# EAGLE schematic cheetah_driver_2 (EAGLE 6.5.0)
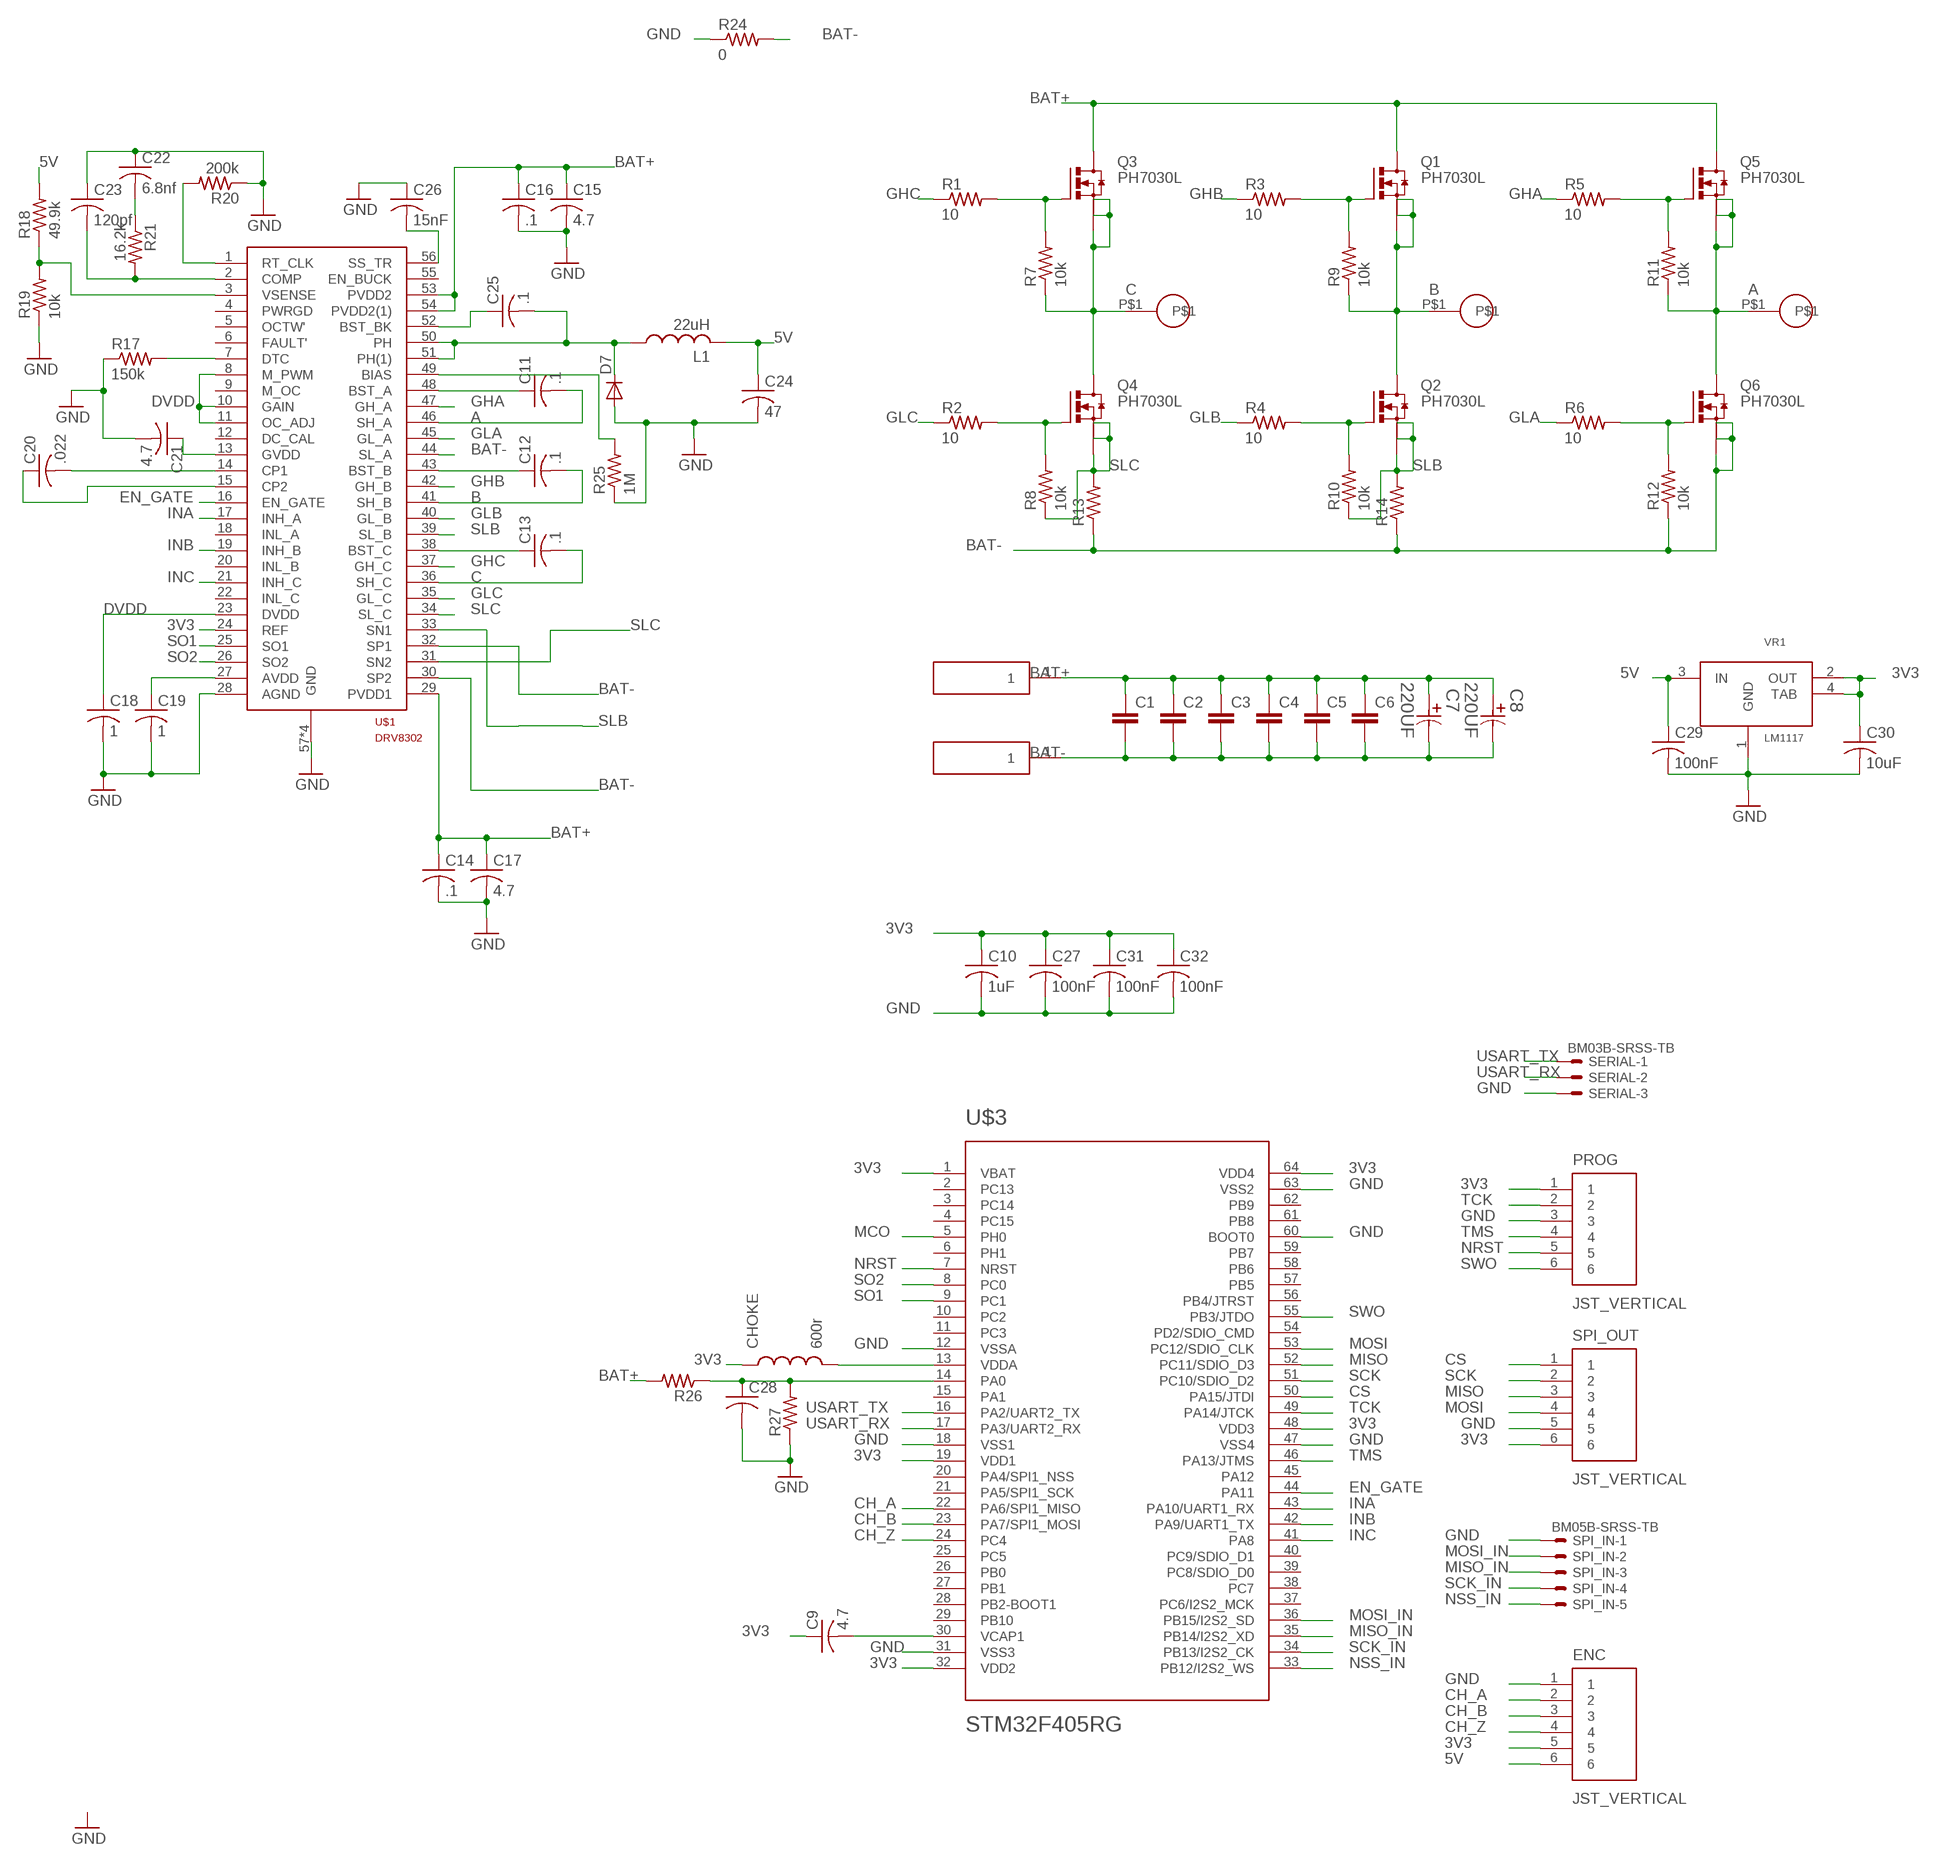
[diagram p0: schematic, sheet 1]

## Parts
C1  C-EUC0805  [C0805]
C2  C-EUC0805  [C0805]
C3  C-EUC0805  [C0805]
C4  C-EUC0805  [C0805]
C5  C-EUC0805  [C0805]
C6  C-EUC0805  [C0805]
C7  220UF  EEE-TK1A221P-CASE-F  [CAPAE830X1050N]
C8  220UF  EEE-TK1A221P-CASE-F  [CAPAE830X1050N]
C9  4.7  C-USC0603  [C0603]
C10  1uF  C-USC0603  [C0603]
C11  .1  C-USC0603  [C0603]
C12  .1  C-USC0603  [C0603]
C13  .1  C-USC0603  [C0603]
C14  .1  C-USC0603  [C0603]
C15  4.7  C-USC0805  [C0805]
C16  .1  C-USC0603  [C0603]
C17  4.7  C-USC0805  [C0805]
C18  1  C-USC0603  [C0603]
C19  1  C-USC0603  [C0603]
C20  .022  C-USC0603  [C0603]
C21  4.7  C-USC0805  [C0805]
C22  6.8nf  C-USC0603  [C0603]
C23  120pf  C-USC0603  [C0603]
C24  47  C-USC1210  [C1210]
C25  .1  C-USC0603  [C0603]
C26  15nF  C-USC0603  [C0603]
C27  100nF  C-USC0603  [C0603]
C28  C-USC0603  [C0603]
C29  100nF  C-USC0603  [C0603]
C30  10uF  C-USC0603  [C0603]
C31  100nF  C-USC0603  [C0603]
C32  100nF  C-USC0603  [C0603]
CHOKE  600r  INDUCTOR0603  [0603]
D7  DIODE-DO-214AC  [DO-214AC]
ENC  JST_VERTICAL  [JST-6-SMD-VERT-1.0MM]
J4  0.125_PAD  [0.125_PAD]
J5  0.125_PAD  [0.125_PAD]
L1  22uH  L-USL4532P  [L4532P]
PROG  JST_VERTICAL  [JST-6-SMD-VERT-1.0MM]
Q1  PH7030L  [SOT669]
Q2  PH7030L  [SOT669]
Q3  PH7030L  [SOT669]
Q4  PH7030L  [SOT669]
Q5  PH7030L  [SOT669]
Q6  PH7030L  [SOT669]
R1  10  R-US_R0603  [R0603]
R2  10  R-US_R0603  [R0603]
R3  10  R-US_R0603  [R0603]
R4  10  R-US_R0603  [R0603]
R5  10  R-US_R0603  [R0603]
R6  10  R-US_R0603  [R0603]
R7  10k  R-US_R0603  [R0603]
R8  10k  R-US_R0603  [R0603]
R9  10k  R-US_R0603  [R0603]
R10  10k  R-US_R0603  [R0603]
R11  10k  R-US_R0603  [R0603]
R12  10k  R-US_R0603  [R0603]
R13  R-US_R1210  [R1210]
R14  R-US_R1210  [R1210]
R17  150k  R-US_R0603  [R0603]
R18  49.9k  R-US_R0603  [R0603]
R19  10k  R-US_R0603  [R0603]
R20  200k  R-US_R0603  [R0603]
R21  16.2k  R-US_R0603  [R0603]
R24  0  R-US_R0603  [R0603]
R25  1M  R-US_R0603  [R0603]
R26  R-US_R0603  [R0603]
R27  R-US_R0603  [R0603]
SERIAL  BM03B-SRSS-TB  [BM03B-SRSS-TB]
SPI_IN  BM05B-SRSS-TB  [BM05B-SRSS-TB]
SPI_OUT  JST_VERTICAL  [JST-6-SMD-VERT-1.0MM]
U$1  DRV8302  [HTSSOP56]
U$2  18_AWG_PAD  [18_AWG_PAD]
U$3  STM32F405RG  [TQFP64]
U$4  18_AWG_PAD  [18_AWG_PAD]
U$5  18_AWG_PAD  [18_AWG_PAD]
VR1  LM1117  [SOT-223]

## Nets
3V3: C9.1 C10.1 C27.1 C30.1 C31.1 C32.1 CHOKE.1 ENC.5 PROG.1 SPI_OUT.6 U$1.24(REF) U$3.1(VBAT) U$3.19(VDD1) U$3.32(VDD2) U$3.48(VDD3) U$3.64(VDD4) VR1.2(OUT) VR1.4(TAB)
5V: C24.1 C29.1 ENC.6 L1.2 R18.2 VR1.3(IN)
A: C11.2 Q5.1(S) Q5.2(S) Q5.3(S) Q6.MB(D) R11.1 U$1.46(SH_A) U$5.P$1
B: C12.2 Q1.1(S) Q1.2(S) Q1.3(S) Q2.MB(D) R9.1 U$1.41(SH_B) U$4.P$1
BAT+: C1.1 C2.1 C3.1 C4.1 C5.1 C6.1 C7.1 C8.1 C14.1 C15.1 C16.1 C17.1 J4.1 Q1.MB(D) Q3.MB(D) Q5.MB(D) R26.2 U$1.29(PVDD1) U$1.53(PVDD2) U$1.54(PVDD2(1))
BAT-: C1.2 C2.2 C3.2 C4.2 C5.2 C6.2 C7.2 C8.2 J5.1 Q6.1(S) Q6.2(S) Q6.3(S) R12.1 R13.1 R14.1 R24.2 U$1.30(SP2) U$1.32(SP1) U$1.44(SL_A)
C: C13.2 Q3.1(S) Q3.2(S) Q3.3(S) Q4.MB(D) R7.1 U$1.36(SH_C) U$2.P$1
CH_A: ENC.2 U$3.22(PA6/SPI1_MISO)
CH_B: ENC.3 U$3.23(PA7/SPI1_MOSI)
CH_Z: ENC.4 U$3.24(PC4)
CS: SPI_OUT.1 U$3.50(PA15/JTDI)
DVDD: C18.1 U$1.8(M_PWM) U$1.10(GAIN) U$1.11(OC_ADJ) U$1.23(DVDD)
EN_GATE: U$1.16(EN_GATE) U$3.44(PA11)
GHA: R5.1 U$1.47(GH_A)
GHB: R3.1 U$1.42(GH_B)
GHC: R1.1 U$1.37(GH_C)
GLA: R6.1 U$1.45(GL_A)
GLB: R4.1 U$1.40(GL_B)
GLC: R2.1 U$1.35(GL_C)
GND: C10.2 C14.2 C15.2 C16.2 C17.2 C18.2 C19.2 C21.2 C22.1 C23.1 C24.2 C26.1 C27.2 C28.2 C29.2 C30.2 C31.2 C32.2 D7.A ENC.1 PROG.3 R17.1 R19.1 R20.1 R24.1 R25.1 R27.1 SERIAL.3 SPI_IN.1 SPI_OUT.5 U$1.28(AGND) U$1.57(GND) U$1.P$1(GND) U$1.P$2(GND) U$1.P$3(GND) U$3.12(VSSA) U$3.18(VSS1) U$3.31(VSS3) U$3.47(VSS4) U$3.60(BOOT0) U$3.63(VSS2) VR1.1(GND)
INA: U$1.17(INH_A) U$3.43(PA10/UART1_RX)
INB: U$1.19(INH_B) U$3.42(PA9/UART1_TX)
INC: U$1.21(INH_C) U$3.41(PA8)
MCO: U$3.5(PH0)
MISO: SPI_OUT.3 U$3.52(PC11/SDIO_D3)
MISO_IN: SPI_IN.3 U$3.35(PB14/I2S2_XD)
MOSI: SPI_OUT.4 U$3.53(PC12/SDIO_CLK)
MOSI_IN: SPI_IN.2 U$3.36(PB15/I2S2_SD)
N$1: Q3.4(G) R1.2 R7.2
N$2: CHOKE.2 U$3.13(VDDA)
N$3: C9.2 U$3.30(VCAP1)
N$4: C11.1 U$1.48(BST_A)
N$5: R25.2 U$1.49(BIAS)
N$6: C13.1 U$1.38(BST_C)
N$7: Q4.4(G) R2.2 R8.2
N$8: Q1.4(G) R3.2 R9.2
N$9: C12.1 U$1.43(BST_B)
N$10: Q5.4(G) R5.2 R11.2
N$11: Q6.4(G) R6.2 R12.2
N$12: R18.1 R19.2 U$1.3(VSENSE)
N$13: R17.2 U$1.7(DTC)
N$14: C19.1 U$1.27(AVDD)
N$15: C20.2 U$1.14(CP1)
N$16: C20.1 U$1.15(CP2)
N$17: C21.1 U$1.13(GVDD)
N$18: C23.2 R21.2 U$1.2(COMP)
N$19: R20.2 U$1.1(RT_CLK)
N$20: C22.2 R21.1
N$21: C25.2 D7.C L1.1 U$1.50(PH) U$1.51(PH(1))
N$22: C25.1 U$1.52(BST_BK)
N$23: C26.2 U$1.56(SS_TR)
N$24: C28.1 R26.1 R27.2 U$3.14(PA0)
N$27: Q2.4(G) R4.2 R10.2
NRST: PROG.5 U$3.7(NRST)
NSS_IN: SPI_IN.5 U$3.33(PB12/I2S2_WS)
SCK: SPI_OUT.2 U$3.51(PC10/SDIO_D2)
SCK_IN: SPI_IN.4 U$3.34(PB13/I2S2_CK)
SLB: Q2.1(S) Q2.2(S) Q2.3(S) R10.1 R14.2 U$1.33(SN1) U$1.39(SL_B)
SLC: Q4.1(S) Q4.2(S) Q4.3(S) R8.1 R13.2 U$1.31(SN2) U$1.34(SL_C)
SO1: U$1.25(SO1) U$3.9(PC1)
SO2: U$1.26(SO2) U$3.8(PC0)
SWO: PROG.6 U$3.55(PB3/JTDO)
TCK: PROG.2 U$3.49(PA14/JTCK)
TMS: PROG.4 U$3.46(PA13/JTMS)
USART_RX: SERIAL.2 U$3.17(PA3/UART2_RX)
USART_TX: SERIAL.1 U$3.16(PA2/UART2_TX)
Unconnected: U$1.4(PWRGD) U$1.5(OCTW') U$1.6(FAULT') U$1.9(M_OC) U$1.12(DC_CAL) U$1.18(INL_A) U$1.20(INL_B) U$1.22(INL_C) U$1.55(EN_BUCK) U$3.2(PC13) U$3.3(PC14) U$3.4(PC15) U$3.6(PH1) U$3.10(PC2) U$3.11(PC3) U$3.15(PA1) U$3.20(PA4/SPI1_NSS) U$3.21(PA5/SPI1_SCK) U$3.25(PC5) U$3.26(PB0) U$3.27(PB1) U$3.28(PB2-BOOT1) U$3.29(PB10) U$3.37(PC6/I2S2_MCK) U$3.38(PC7) U$3.39(PC8/SDIO_D0) U$3.40(PC9/SDIO_D1) U$3.45(PA12) U$3.54(PD2/SDIO_CMD) U$3.56(PB4/JTRST) U$3.57(PB5) U$3.58(PB6) U$3.59(PB7) U$3.61(PB8) U$3.62(PB9)

## Library data of the parts
C1-C6 = rcl:C-EU: CAPACITOR, European symbol
C7 C8 = Panasonic-EEEH_EEET_EEHZ_EEV:EEE-: Aluminum Electrolytic Capacitors,Surface Mount Type; MPN: EEE-TK1A221P; OC_FARNELL: 2079169; OC_NEWARK: 83T6947; PACKAGE: CASE-F; SUPPLIER: PANASONIC; TOLERANCE: ±20 %; VOLTAGERATING: 10V
C9-C32 = rcl:C-US: CAPACITOR, American symbol
CHOKE = SparkFun-Passives:INDUCTOR: Inductors Basic Inductor/Choke - 0603 and 1206. Footprints are not proven and vary greatly between part numbers. INDUCTOR POWER 3.3UH 4.0A SMD 0.197" L x 0.197" W x 0.177" H (5.00mm x 5.00mm x 4.50mm)
D7 = diode:DIODE-: DIODE
ENC PROG SPI_OUT = SparkFun-Connectors:JST_VERTICAL; PROD_ID: CONN-08249
J4 J5 = sc_usercreated:0.125_PAD
L1 = rcl:L-US: INDUCTOR, American symbol
Q1-Q6 = transistor-power:PH7030L: N-channel TrenchMOS (TM) logic level FET Source: http://www.nxp.com/acrobat_download/datasheets/PH7030L_4.pdf
R1-R14 R17-R21 R24-R27 = rcl:R-US_: RESISTOR, American symbol
SERIAL = con-jst2:?M03B-SRSS-TB: Disconnectable Crimp style connector, 1.0mm pitch 3 contacts
SPI_IN = con-jst2:?M05B-SRSS-TB: Disconnectable Crimp style connector, 1.0mm pitch 5 contacts
U$1 = ASL (1):DRV8302
U$2 U$4 U$5 = BenLibrary:18_AWG_PAD
U$3 = BenLibrary:STM32F405RG: ARM DSP Chip used on the WAV Trigger board.
VR1 = sc_usercreated:LM1117